# EAGLE design SoundSensor (EAGLE 9.6.2)
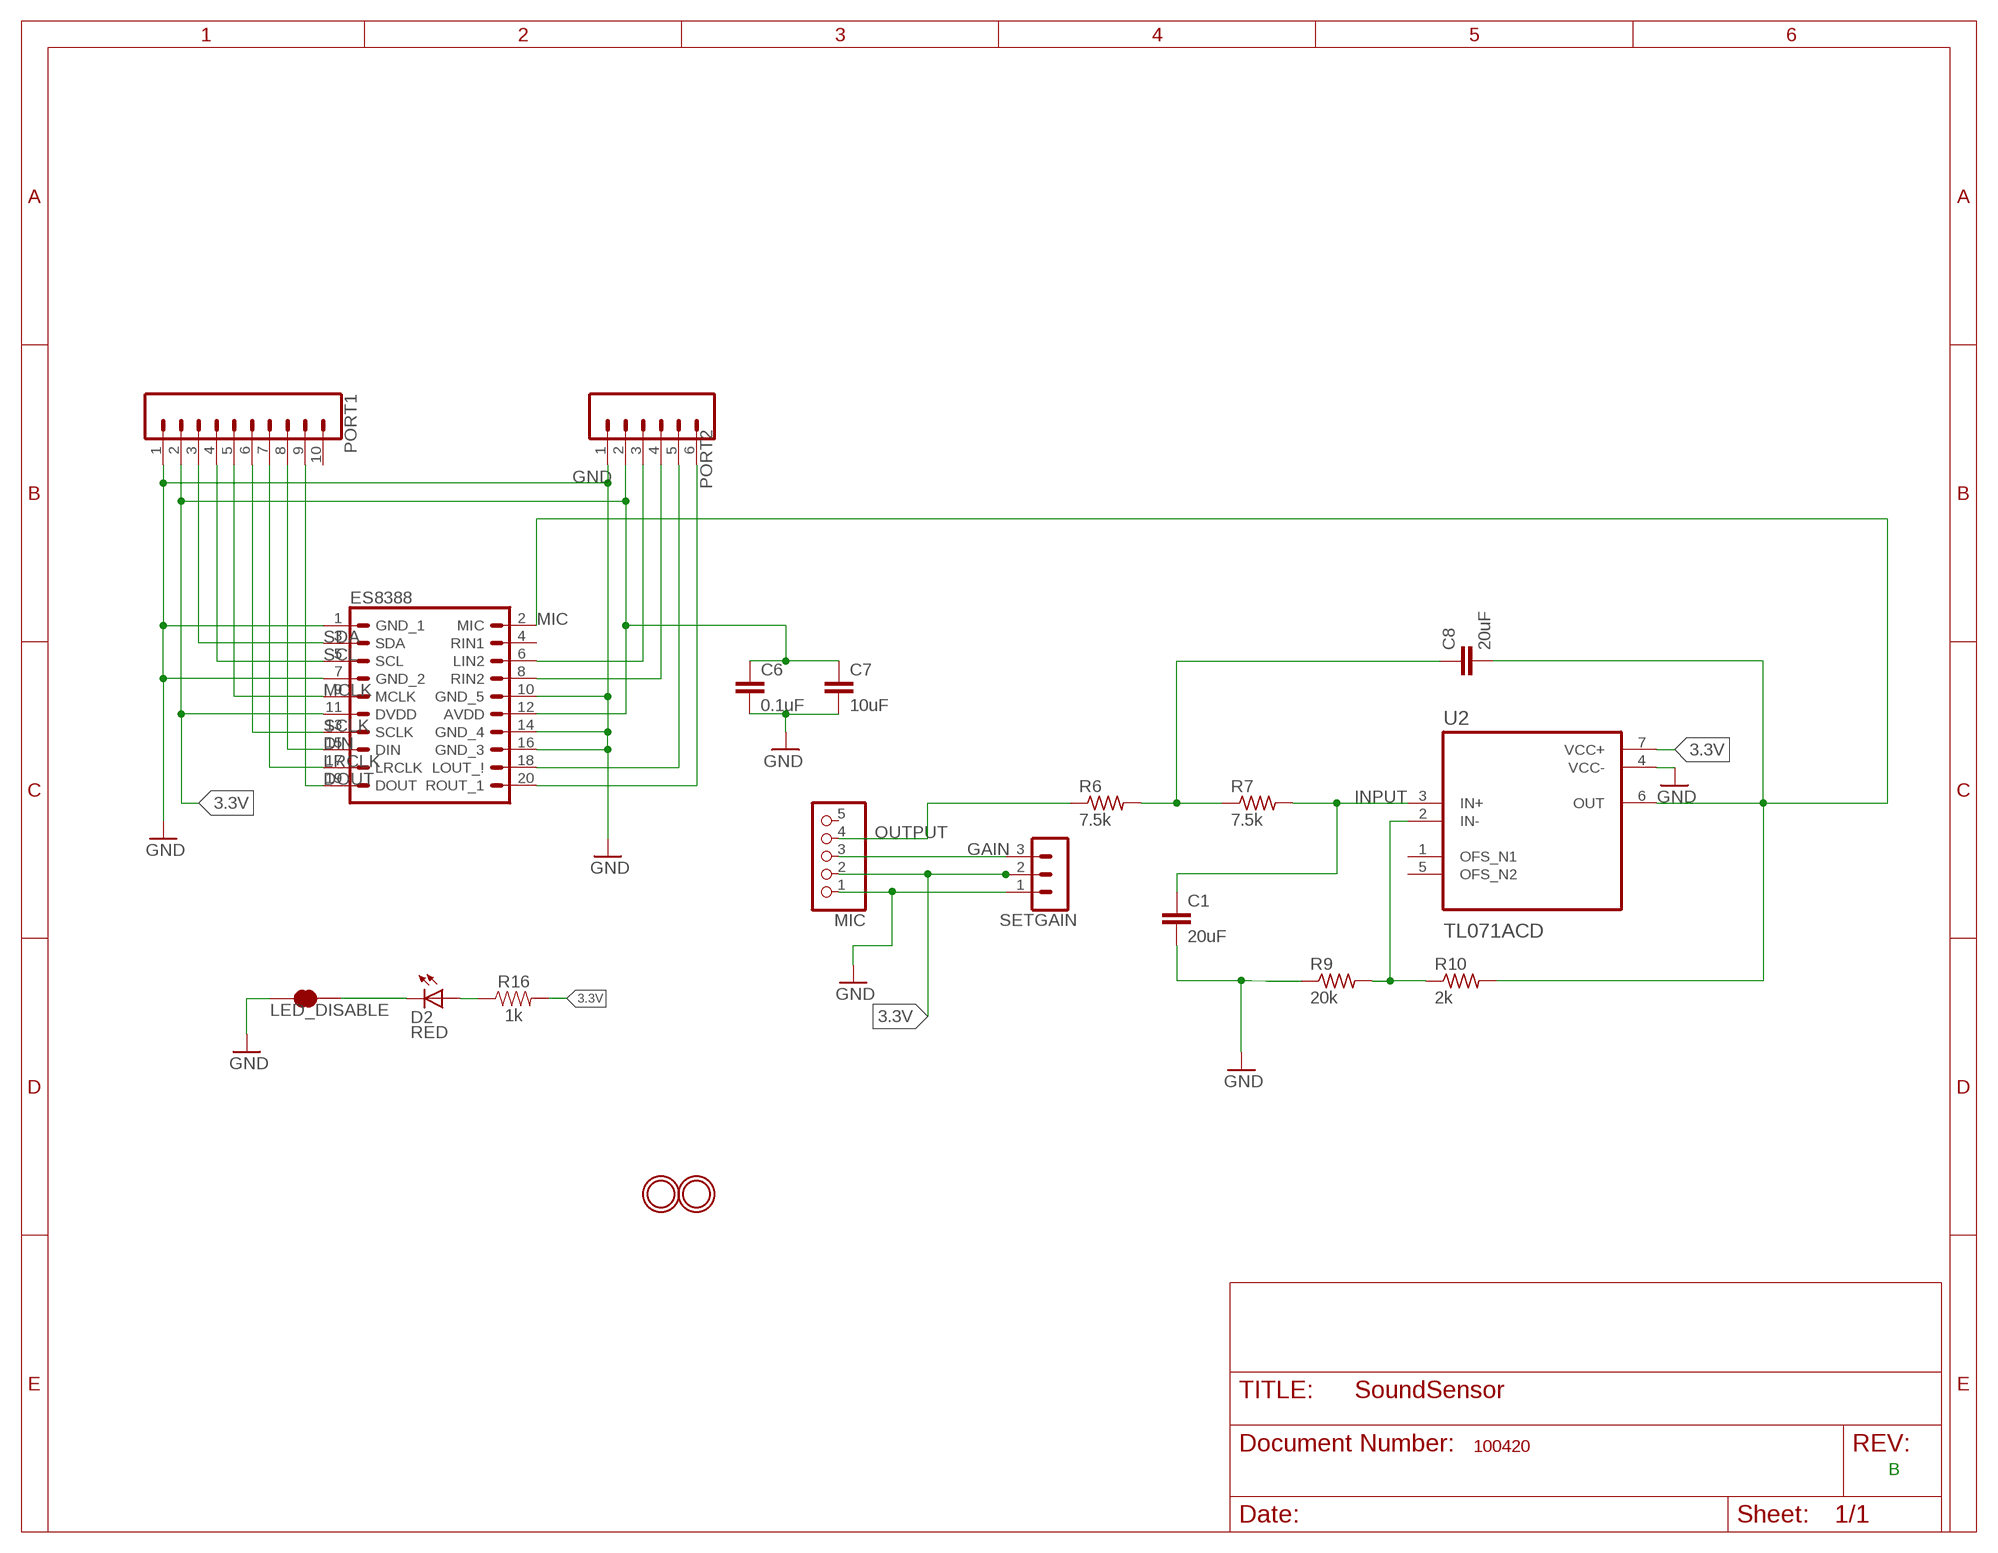
[diagram p0: schematic, sheet 1]

## Parts
C1  20uF  C-EUC0603  [C0603]
C6  0.1uF  C-EUC0603  [C0603]
C7  10uF  C-EUC0603  [C0603]
C8  20uF  C-EUC0603  [C0603]
D2  RED  LED-RED0603  [LED-0603]
ES8388  ES8388ES8388  [ES8388]
LED_DISABLE  JUMPER-SMT_2_NC_TRACE_SILK  [SMT-JUMPER_2_NC_TRACE_SILK]
MIC  HEADER-1X576MIL  [1X05_ROUND_76]
PORT1  CONN_10"  [1X10]
PORT2  CONN_06SILK_FEMALE_PTH  [1X06]
R6  7.5k  R-US_R0603  [R0603]
R7  7.5k  R-US_R0603  [R0603]
R9  20k  R-US_R0603  [R0603]
R10  2k  R-US_R0603  [R0603]
R16  1k  1KOHM-0603-1/10W-1%  [0603]
SETGAIN  MA03-1  [MA03-1]
U2  TL071ACD  [SOIC127P599X175-8N]
U$1  MOUNTINGHOLE2.0  [MOUNTINGHOLE_2.0_PLATED]
U$5  MOUNTINGHOLE2.0  [MOUNTINGHOLE_2.0_PLATED]

## Nets
3.3V: C6.1 C7.1 ES8388.11(DVDD) ES8388.12(AVDD) MIC.2 PORT1.2 PORT2.2 R16.2 SETGAIN.2 U2.7(VCC+)
DIN: ES8388.15(DIN) PORT1.8
DOUT: ES8388.19(DOUT) PORT1.9
GAIN: MIC.3 SETGAIN.3
GND: C1.2 C6.2 C7.2 ES8388.1(GND_1) ES8388.7(GND_2) ES8388.10(GND_5) ES8388.14(GND_4) ES8388.16(GND_3) LED_DISABLE.1 MIC.1 PORT1.1 PORT2.1 R9.1 SETGAIN.1 U2.4(VCC-)
INPUT: C1.1 R7.2 U2.3(IN+)
LRCLK: ES8388.17(LRCLK) PORT1.7
MCLK: ES8388.9(MCLK) PORT1.5
MIC: C8.2 ES8388.2(MIC) R10.2 U2.6(OUT)
N$1: ES8388.6(LIN2) PORT2.3
N$2: ES8388.8(RIN2) PORT2.4
N$10: ES8388.18(LOUT_!) PORT2.5
N$11: ES8388.20(ROUT_1) PORT2.6
N$12: C8.1 R6.2 R7.1
N$16: R9.2 R10.1 U2.2(IN-)
N$26: D2.A R16.1
N$28: D2.C LED_DISABLE.2
OUTPUT: MIC.4 R6.1
SCL: ES8388.5(SCL) PORT1.4
SCLK: ES8388.13(SCLK) PORT1.6
SDA: ES8388.3(SDA) PORT1.3
Unconnected: ES8388.4(RIN1) MIC.5 PORT1.10 U2.1(OFS_N1) U2.5(OFS_N2)

## Notes on the sheet
- 100420
- B

## Library data of the parts
C1 C6-C8 = rcl:C-EU: CAPACITOR, European symbol; SPICEPREFIX: C
D2 = SparkFun-LED:LED-RED: Assorted Red LEDs LilyPad 1206- DIO-09912 1206- DIO-00809 0603- DIO-00819; PROD_ID: DIO-00819
ES8388 = ES8388 :ES8388: ES8388 PCBArtists Breakout Board ESP-ADF COMPATIBLE AUDIO CODEC FOR ESP32 Breakout Board ES8388 <https://pcbartists.com/es8388/> Special note about the "SPECIAL" package: This was SPECIALLY designed to be used with PCBArtists ES8388
LED_DISABLE = SparkFun-Jumpers:JUMPER-SMT_2_NC_TRACE: Normally closed trace jumper This jumper has a trace between two pads so it's normally closed (NC). Use a razor knife to open the connection. For best results follow the IPC guidelines for cutting traces: Cutout at least 0.063 mm (0.005 in). Remove all loose material to clean up the cut area. Seal the cut with an approved epoxy. Reapply solder to reclose the connection.
MIC = microbuilder:HEADER-1X5: PIN HEADER
PORT1 = SparkFun-Connectors:CONN_10: Multi connection point. Often used as Generic Header-pin footprint for 0.1 inch spaced/style header connections On any of the 0.1 inch spaced packages, you can populate with these: Break Away Headers - Straight <https://www.sparkfun.com/products/116> (PRT-00116) Break Away Male Headers - Right Angle <https://www.sparkfun.com/products/553> (PRT-00553) Female Headers <https://www.sparkfun.com/products/115> (PRT-00115) Break Away Headers - Machine Pin <https://www.sparkfun.com/products/117> (PRT-00117) Break Away Female Headers - Swiss Machine Pin <https://www.sparkfun.com/products/743> (PRT-00743) Arduino Stackable Header - 10 Pin <https://www.sparkfun.com/products/11376> (PRT-11376) For SCREWTERMINALS and SPRING TERMINALS visit here: Screw Terimnals on SparkFun.com <https://www.sparkfun.com/search/results?term=Screw+Terminals> (5mm/3.5mm/2.54mm spacing) This device is also useful as a general connection point to wire up your design to another part of your project. Our various solder wires solder well into these plated through hole pads. Hook-Up Wire - Assortment (Stranded, 22 AWG) <https://www.sparkfun.com/products/11375> (PRT-11375) Hook-Up Wire - Assortment (Solid Core, 22 AWG) <https://www.sparkfun.com/products/11367> (PRT-11367) View the entire wire category on our website here <https://www.sparkfun.com/categories/141> Special notes: Molex polarized connector foot print use with SKU : PRT-08231 with associated crimp pins and housings. 1MM SMD Version SKU: PRT-10208 NOTES ON THE VARIANTS LOCK and LOCK_LONGPADS... This footprint was designed to help hold the alignment of a through-hole component (i.e. 6-pin header) while soldering it into place. You may notice that each hole has been shifted either up or down by 0.005 of an inch from it's more standard position (which is a perfectly straight line). This slight alteration caused the pins (the squares in the middle) to touch the edges of the holes. Because they are alternating, it causes a "brace" to hold the component in place. 0.005 has proven to be the perfect amount of "off-center" position when using our standard breakaway headers. Although looks a little odd when you look at the bare footprint, once you have a header in there, the alteration is very hard to notice. Also,if you push a header all the way into place, it is covered up entirely on the bottom side.; PROD_ID: CONN-11563
PORT2 = SparkFun-Connectors:CONN_06: Multi connection point. Often used as Generic Header-pin footprint for 0.1 inch spaced/style header connections On any of the 0.1 inch spaced packages, you can populate with these: Break Away Headers - Straight <https://www.sparkfun.com/products/116> (PRT-00116) Break Away Male Headers - Right Angle <https://www.sparkfun.com/products/553> (PRT-00553) Female Headers <https://www.sparkfun.com/products/115> (PRT-00115) Break Away Headers - Machine Pin <https://www.sparkfun.com/products/117> (PRT-00117) Break Away Female Headers - Swiss Machine Pin <https://www.sparkfun.com/products/743> (PRT-00743) Arduino Stackable Header - 6 Pin <https://www.sparkfun.com/products/9280> (PRT-09280) For SCREWTERMINALS and SPRING TERMINALS visit here: Screw Terimnals on SparkFun.com <https://www.sparkfun.com/search/results?term=Screw+Terminals> (5mm/3.5mm/2.54mm spacing) This device is also useful as a general connection point to wire up your design to another part of your project. Our various solder wires solder well into these plated through hole pads. Hook-Up Wire - Assortment (Stranded, 22 AWG) <https://www.sparkfun.com/products/11375> (PRT-11375) Hook-Up Wire - Assortment (Solid Core, 22 AWG) <https://www.sparkfun.com/products/11367> (PRT-11367) View the entire wire category on our website here <https://www.sparkfun.com/categories/141>; PROD_ID: CONN-08437
R6 R7 R9 R10 = rcl:R-US_: RESISTOR, American symbol; SPICEPREFIX: R
R16 = SparkFun-Resistors:1KOHM: 1kΩ resistor A resistor is a passive two-terminal electrical component that implements electrical resistance as a circuit element. Resistors act to reduce current flow, and, at the same time, act to lower voltage levels within circuits. - Wikipedia; PROD_ID: RES-07856
SETGAIN = con-lstb:MA03-1: PIN HEADER; OC_FARNELL: unknown; OC_NEWARK: unknown
U2 = TL071ACD:TL071ACD: Check availability <https://pricing.snapeda.com/parts/TL071ACD/Texas%20Instruments/view-part?ref=eda>; AVAILABILITY: In Stock; CHECK_PRICES: https://www.snapeda.com/parts/TL071ACD/Texas+Instruments/view-part/?ref=eda; DESCRIPTION: Single, 30-V, 3-MHz, high slew rate (13-V/µs), 6-mV offset voltage, In to V+, JFET-input op amp; MF: Texas Instruments; MP: TL071ACD; PACKAGE: SOIC-8 Texas Instruments; PRICE: None; SNAPEDA_LINK: https://www.snapeda.com/parts/TL071ACD/Texas+Instruments/view-part/?ref=snap
U$1 U$5 = microbuilder:MOUNTINGHOLE: Mounting Hole For #2 screws (0.086"/2.18mm width, 0.094"/2.4mm hole) use 2.5mm

## Module ASD
Ports: 

### Library data of the parts

## Board
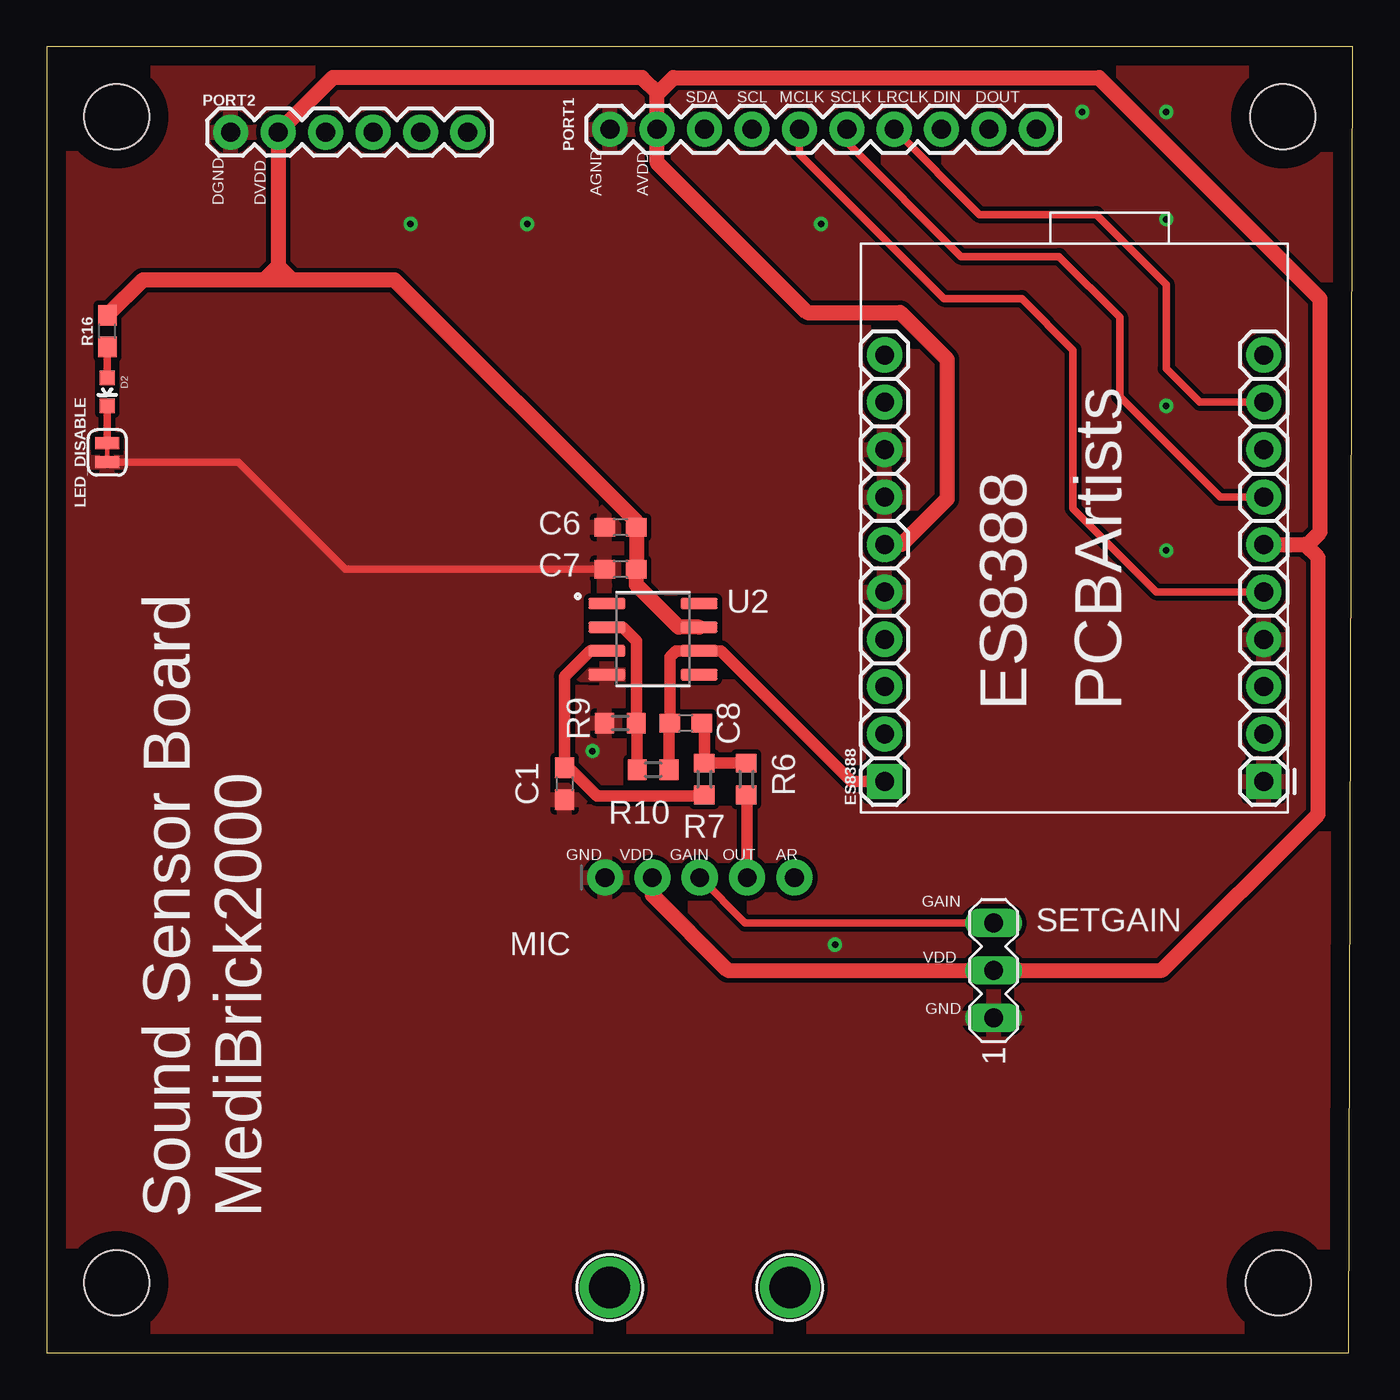
[diagram p1: board, top side]
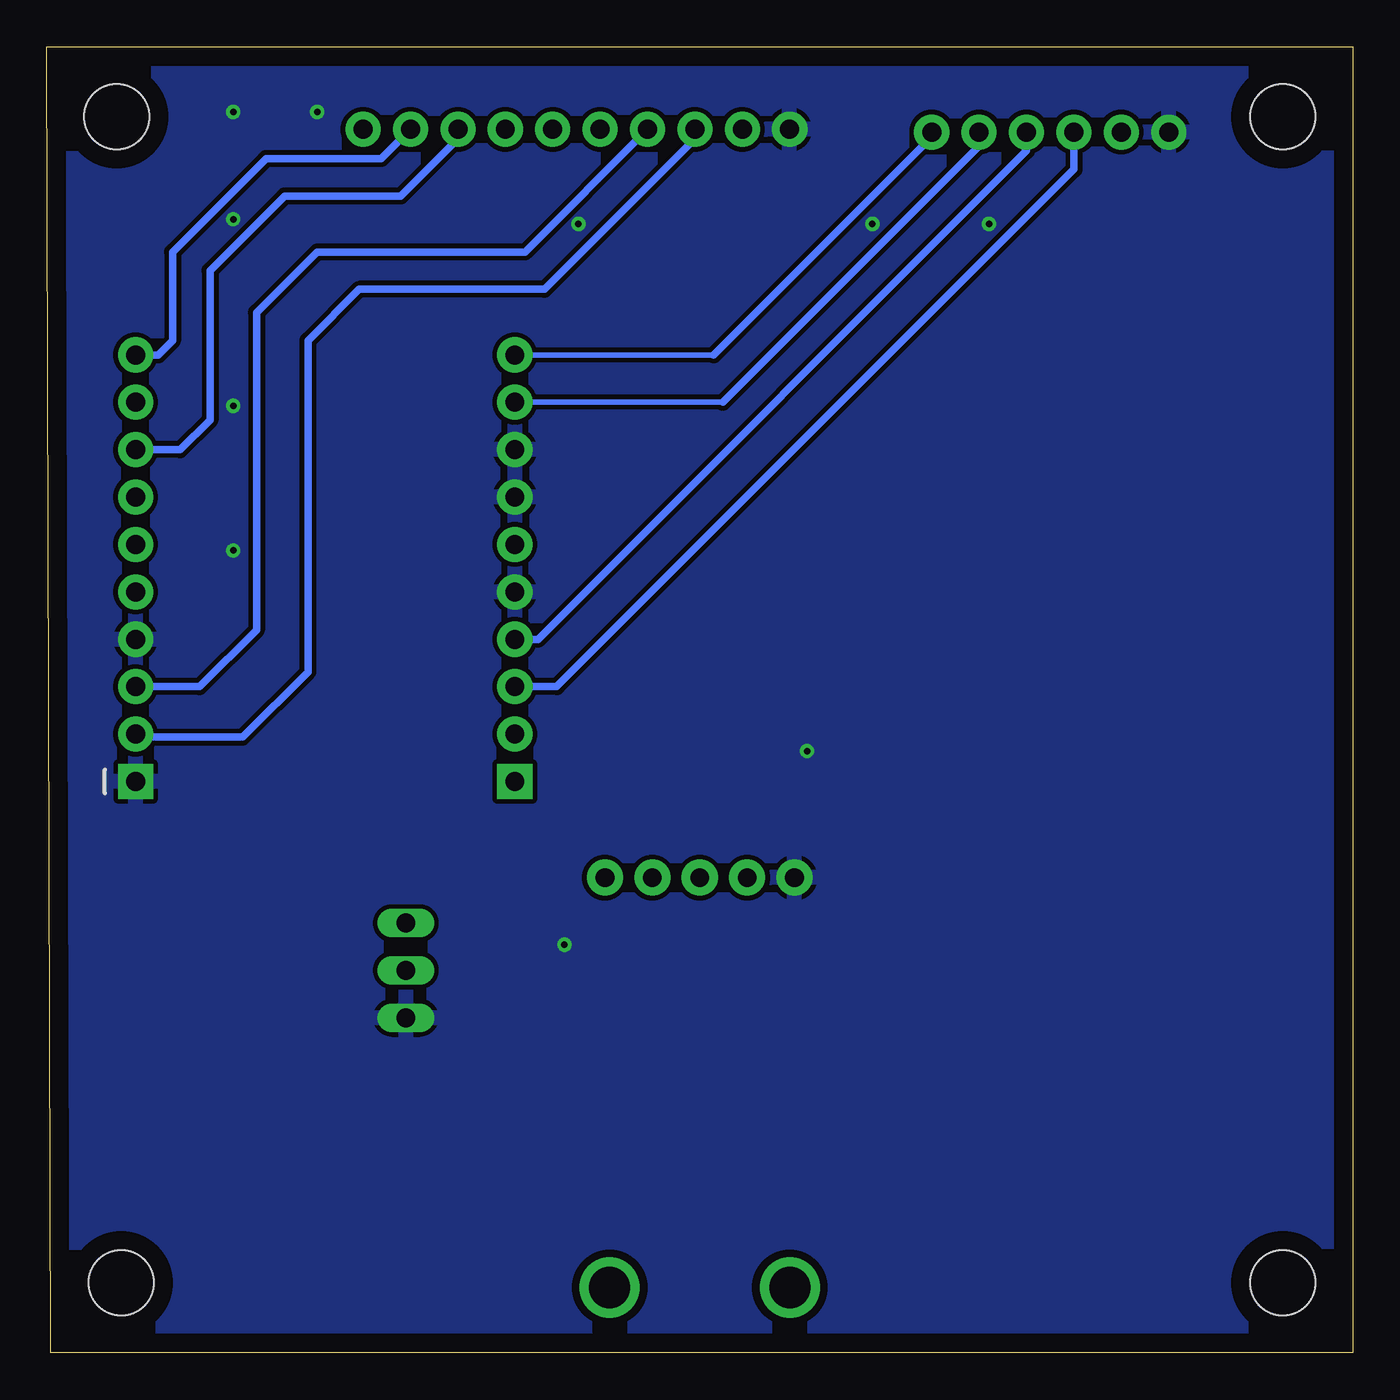
[diagram p2: board, bottom side, seen from below]

Size 70 x 70 mm. Coordinates in mm from the lower left corner, seen from the top.
Outline: 0,0 69.79,0 70,70 0,70 0,0
Copper layers (1*16): Top 0.035mm / dielectric 1.5mm / Bottom 0.035mm
Design rules "default *": minimum track width 6mil, minimum drill 0.35mm, track to track 10mil, track to pad 10mil, pad to pad 10mil, via to via 10mil, smd to smd 10mil, copper to edge 40mil, drill to drill 6mil, minimum pad ring 10mil, minimum via ring 8mil, stop-mask expansion 4mil, vias tented up to drill 0mil, thermal gap 10mil
Holes 3.5 mm at 3.75,3.75 3.75,66.25 66,3.75 66.25,66.25

### Footprints (pad centres in the part's own frame; a part is rotated, then mirrored left to right if it is on the bottom)
C0603 = smd 1.1 x 1: 1 -0.85,0; 2 0.85,0
LED-0603 = smd 0.8 x 0.8: A 0,-0.75; C 0,0.75
ES8388 = drill 1.016 pad 1.88 square: 1 0,0; 2 0,20.32 | drill 1.016 pad 1.88: 3 2.54,0; 4 2.54,20.32; 5 5.08,0; 6 5.08,20.32; 7 7.62,0; 8 7.62,20.32; 9 10.16,0; 10 10.16,20.32; 11 12.7,0; 12 12.7,20.32; 13 15.24,0; 14 15.24,20.32; 15 17.78,0; 16 17.78,20.32; 17 20.32,0; 18 20.32,20.32; 19 22.86,0; 20 22.86,20.32
SMT-JUMPER_2_NC_TRACE_SILK = smd 0.635 x 1.27: 1 -0.508,0; 2 0.508,0
1X05_ROUND_76 = drill 1 pad 1.93: 1 -5.08,0; 2 -2.54,0; 3 0,0; 4 2.54,0; 5 5.08,0
1X10 = drill 1.016 pad 1.88: 1 0,0; 2 2.54,0; 3 5.08,0; 4 7.62,0; 5 10.16,0; 6 12.7,0; 7 15.24,0; 8 17.78,0; 9 20.32,0; 10 22.86,0
1X06 = drill 1.016 pad 1.88: 1 0,0; 2 2.54,0; 3 5.08,0; 4 7.62,0; 5 10.16,0; 6 12.7,0
R0603 = smd 1 x 1.1: 1 -0.85,0; 2 0.85,0
0603 = smd 1.1 x 1: 1 -0.85,0; 2 0.85,0
MA03-1 = drill 1.016 long: 1 -2.54,0; 2 0,0; 3 2.54,0
SOIC127P599X175-8N = smd 1.97 x 0.6: 1 -2.47,1.905; 2 -2.47,0.635; 3 -2.47,-0.635; 4 -2.47,-1.905; 5 2.47,-1.905; 6 2.47,-0.635; 7 2.47,0.635; 8 2.47,1.905
MOUNTINGHOLE_2.0_PLATED = drill 2.2 pad 3: P$1 0,0

### Placement (x,y rotation side)
C1  27.75,30.5 270 top
C6  30.75,44.25 180 top
C7  30.75,42 180 top
C8  34.25,33.75 180 top
D2  3.25,51.5 180 top
ES8388  65.23,30.62 90 top
LED_DISABLE  3.25,48.25 90 top
MIC  35,25.47 0 top
PORT1  30.18,65.57 0 top
PORT2  9.87,65.42 0 top
R6  37.5,30.75 90 top
R7  35.25,30.75 270 top
R9  30.75,33.75 0 top
R10  32.5,31.25 0 top
R16  3.25,54.75 90 top
SETGAIN  50.75,20.5 90 top
U2  32.5,38.25 0 top
U$1  30.17,3.5 0 top
U$5  39.83,3.5 0 top

### Tracks (layer width: path | path; a pad name or v marks a point on that pad's centre or on a via)
3.3V
  Top 0.508: 67.43,43.32 67.5,43.25
  Top 0.813: ES8388.12 45.82,43.32 48.25,45.75 48.25,53.25 45.75,55.75 40.75,55.75 32.72,63.78 PORT1.2 32.72,67.47 32.75,67.5 | ES8388.11 67.43,43.32 68.14,42.62 68.14,28.86 59.77,20.5 SETGAIN.2 36.49,20.5 32.46,24.53 MIC.2 | 32.75,67.5 31.91,68.34 15.33,68.34 PORT2.2 12.41,58.25 | 32.75,67.5 33.59,68.34 56.39,68.34 68.25,56.48 68.25,44 67.5,43.25 | 12.41,58.25 12.41,57.5 | 13.16,57.5 18.66,57.5 31.6,44.56 C6.1 C7.1 31.6,41.15 33.87,38.88 U2.7 | 13.16,57.5 12.41,57.5 | 12.41,57.5 11.66,57.5 | 11.66,57.5 5.15,57.5 R16.2 | 12.41,58.25 13.16,57.5 | 12.41,58.25 11.66,57.5
DIN
  Bottom 0.406: PORT1.8 47.96,65.07 51.03,62 57.25,62 61.25,58 61.25,50 62.85,48.4 ES8388.15
DOUT
  Bottom 0.406: PORT1.9 52.07,64 58.25,64 63.25,59 63.25,54.25 64.02,53.48 ES8388.19
GAIN
  Top 0.406: MIC.3 37.43,23.04 SETGAIN.3
GND  (via drill 0.35)
  Top 0.406: LED_DISABLE.1 10.26,47.74 16,42 C7.2
  other vias: 60,43 60,50.75 41.5,60.5 25.75,60.5 19.5,60.5 60,60.75 55.5,66.5 60,66.5 42.25,21.87 29.25,32.25
  pour Top: 0.25,70 70.25,70 70.25,-0.25 69.5,-0.25 0.25,-0.25 0.25,5.75
  pour Bottom: 0.25,70.25 70.25,70.25 70.25,67.75 70.25,-0.25 70,-0.25 0.25,-0.25
INPUT
  Top 0.61: U2.3 29.11,37.62 27.75,36.25 C1.1 28,31.35 29.5,29.85 35.2,29.85 R7.2
LRCLK
  Top 0.406: PORT1.7 49.99,61 56.25,61 60,57.25 60,52.75 61.81,50.94 ES8388.17
MCLK
  Top 0.406: PORT1.5 40.34,64.25 48.09,56.5 52.25,56.5 55,53.75 55,45.25 59.47,40.78 ES8388.9
MIC
  Top 0.61: ES8388.2 43.13,30.62 36.13,37.62 U2.6 33.72,37.62 33.4,37.3 C8.2 33.35,33.75 R10.2
N$1
  Bottom 0.406: PORT2.3 14.95,63.42 42.67,35.7 ES8388.6
N$2
  Bottom 0.406: PORT2.4 17.49,64.42 43.67,38.24 ES8388.8
N$10
  Bottom 0.305: 33.76,50.94 ES8388.18
  Bottom 0.406: 33.76,50.94 20.03,64.67 PORT2.5
N$11
  Bottom 0.305: 34.26,53.48 ES8388.20
  Bottom 0.406: 34.26,53.48 22.57,65.17 PORT2.6
N$12
  Top 0.61: R6.2 R7.1 35.25,33.6 C8.1
N$16
  Top 0.61: U2.2 30.86,38.88 31.6,38.15 R9.2 31.65,33.7 R10.1
N$26
  Top 0.406: R16.1 D2.A
N$28
  Top 0.406: LED_DISABLE.2 D2.C
OUTPUT
  Top 0.61: R6.1 37.54,29.86 MIC.4
SCL
  Bottom 0.406: PORT1.4 44.37,59 55.5,59 58.75,55.75 58.75,38.75 61.8,35.7 ES8388.5
SCLK
  Top 0.406: PORT1.6 42.88,64.87 49,58.75 54.25,58.75 57.5,55.5 57.5,51.25 62.89,45.86 ES8388.13
SDA
  Bottom 0.406: PORT1.3 35.26,65.07 43.33,57 53.25,57 56,54.25 56,36.5 59.5,33 65.07,33 ES8388.3

### Text on the board
tNames: SDA | SCL | MCLK | SCLK | LRCLK | DIN | DOUT | DGND | DVDD | AGND | AVDD | GND | VDD | GAIN | OUT | AR | GAIN | VDD | GND | Sound Sensor Board / MediBrick2000